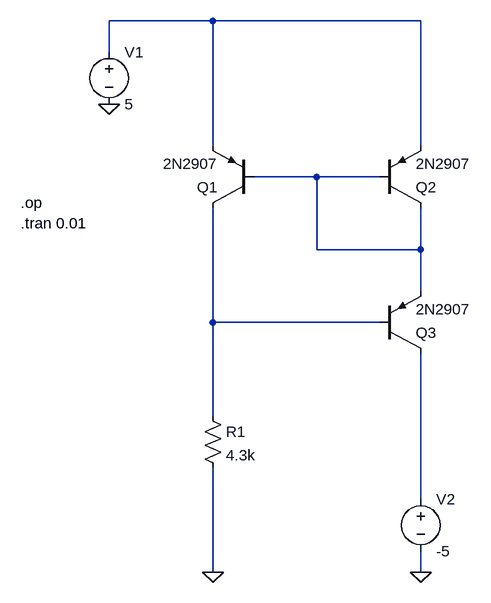
[diagram p0: schematic Test 2.asc]
Test 2.asc, the LTspice schematic file:
Version 4
SHEET 1 880 832
WIRE 320 -32 160 -32
WIRE 640 -32 320 -32
WIRE 160 16 160 -32
WIRE 320 160 320 -32
WIRE 640 160 640 -32
WIRE 480 208 384 208
WIRE 576 208 480 208
WIRE 480 320 480 208
WIRE 640 320 640 256
WIRE 640 320 480 320
WIRE 640 384 640 320
WIRE 320 432 320 256
WIRE 576 432 320 432
WIRE 320 576 320 432
WIRE 640 704 640 480
WIRE 320 816 320 656
WIRE 640 816 640 784
FLAG 160 96 0
FLAG 640 816 0
FLAG 320 816 0
SYMBOL voltage 160 0 R0
SYMATTR InstName V1
SYMATTR Value 5
SYMBOL pnp 384 256 R180
SYMATTR InstName Q1
SYMATTR Value 2N2907
SYMBOL pnp 576 256 M180
SYMATTR InstName Q2
SYMATTR Value 2N2907
SYMBOL pnp 576 480 M180
SYMATTR InstName Q3
SYMATTR Value 2N2907
SYMBOL res 304 560 R0
SYMATTR InstName R1
SYMATTR Value 4.3k
SYMBOL voltage 640 688 R0
SYMATTR InstName V2
SYMATTR Value -5
TEXT 24 248 Left 2 !.op\n.tran 0.01

The netlist it stands for:
* Test 2.asc
V1 N001 0 5
Q1 N003 N002 N001 0 2N2907
Q2 N002 N002 N001 0 2N2907
Q3 N004 N003 N002 0 2N2907
R1 N003 0 4.3k
V2 N004 0 -5
.model NPN NPN
.model PNP PNP
.lib standard.bjt
.op
.tran 0.01
.backanno
.end